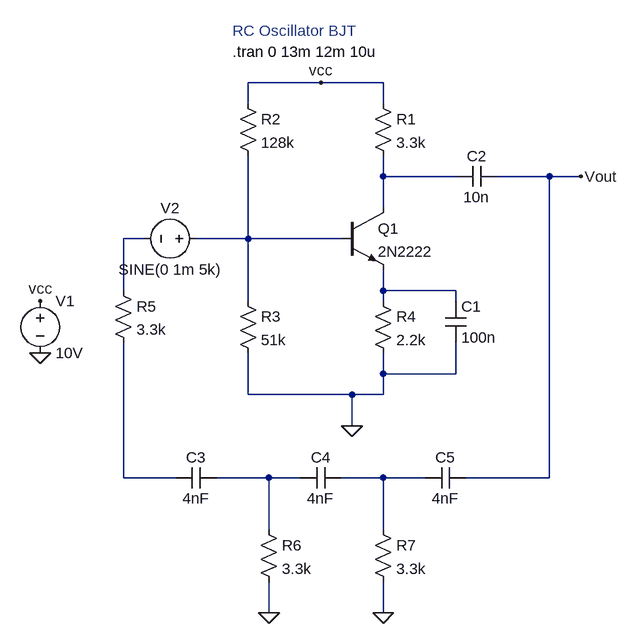
[diagram p0: schematic RC_oscillator_BJT.asc]
RC_oscillator_BJT.asc, the LTspice schematic file:
Version 4.1
SHEET 1 880 712
WIRE 0 -144 -112 -144
WIRE 96 -144 0 -144
WIRE -112 -112 -112 -144
WIRE 96 -112 96 -144
WIRE 96 0 96 -32
WIRE 208 0 96 0
WIRE 352 0 272 0
WIRE 400 0 352 0
WIRE 96 48 96 0
WIRE -272 96 -304 96
WIRE -112 96 -112 -32
WIRE -112 96 -192 96
WIRE 32 96 -112 96
WIRE -304 176 -304 96
WIRE 96 176 96 144
WIRE 208 176 96 176
WIRE -112 192 -112 96
WIRE 96 192 96 176
WIRE 208 192 208 176
WIRE 96 304 96 272
WIRE 208 304 208 256
WIRE 208 304 96 304
WIRE -112 336 -112 272
WIRE 48 336 -112 336
WIRE 96 336 96 304
WIRE 96 336 48 336
WIRE 48 384 48 336
WIRE -304 464 -304 256
WIRE -224 464 -304 464
WIRE -80 464 -160 464
WIRE -32 464 -80 464
WIRE 96 464 32 464
WIRE 160 464 96 464
WIRE 352 464 352 0
WIRE 352 464 224 464
WIRE -80 544 -80 464
WIRE 96 544 96 464
WIRE -80 672 -80 624
WIRE 96 672 96 624
FLAG 48 384 0
FLAG 400 0 Vout
FLAG -80 672 0
FLAG 96 672 0
FLAG 0 -144 vcc
FLAG -432 192 vcc
FLAG -432 272 0
SYMBOL npn 32 48 R0
SYMATTR InstName Q1
SYMATTR Value 2N2222
SYMBOL res 80 -128 R0
SYMATTR InstName R1
SYMATTR Value 3.3k
SYMBOL res -128 -128 R0
SYMATTR InstName R2
SYMATTR Value 128k
SYMBOL res -128 176 R0
SYMATTR InstName R3
SYMATTR Value 51k
SYMBOL res 80 176 R0
SYMATTR InstName R4
SYMATTR Value 2.2k
SYMBOL cap 192 192 R0
SYMATTR InstName C1
SYMATTR Value 100n
SYMBOL cap 272 -16 R90
WINDOW 0 0 32 VBottom 2
WINDOW 3 32 32 VTop 2
SYMATTR InstName C2
SYMATTR Value 10n
SYMBOL res -320 160 R0
SYMATTR InstName R5
SYMATTR Value 3.3k
SYMBOL cap -160 448 R90
WINDOW 0 0 32 VBottom 2
WINDOW 3 32 32 VTop 2
SYMATTR InstName C3
SYMATTR Value 4nF
SYMBOL cap 32 448 R90
WINDOW 0 0 32 VBottom 2
WINDOW 3 32 32 VTop 2
SYMATTR InstName C4
SYMATTR Value 4nF
SYMBOL cap 224 448 R90
WINDOW 0 0 32 VBottom 2
WINDOW 3 32 32 VTop 2
SYMATTR InstName C5
SYMATTR Value 4nF
SYMBOL res -96 528 R0
SYMATTR InstName R6
SYMATTR Value 3.3k
SYMBOL res 80 528 R0
SYMATTR InstName R7
SYMATTR Value 3.3k
SYMBOL voltage -432 176 R0
WINDOW 123 0 0 Left 0
WINDOW 39 0 0 Left 0
SYMATTR InstName V1
SYMATTR Value 10V
SYMBOL voltage -176 96 R90
WINDOW 0 -32 56 VBottom 2
WINDOW 3 32 56 VTop 2
WINDOW 123 0 0 Left 0
WINDOW 39 0 0 Left 0
SYMATTR InstName V2
SYMATTR Value SINE(0 1m 5k)
TEXT -136 -192 Left 2 !.tran 0 13m 12m 10u
TEXT -136 -224 Left 2 ;RC Oscillator BJT

The netlist it stands for:
* RC_oscillator_BJT.asc
Q1 N001 N003 N004 0 2N2222
R1 vcc N001 3.3k
R2 vcc N003 128k
R3 N003 0 51k
R4 N004 0 2.2k
C1 N004 0 100n
C2 Vout N001 10n
R5 N002 N005 3.3k
C3 N006 N005 4nF
C4 N007 N006 4nF
C5 Vout N007 4nF
R6 N006 0 3.3k
R7 N007 0 3.3k
V1 vcc 0 10V
V2 N003 N002 SINE(0 1m 5k)
.model NPN NPN
.model PNP PNP
.lib standard.bjt
.tran 0 13m 12m 10u
* RC Oscillator BJT
.backanno
.end